# EAGLE design 9235HallEffectV1.0 (EAGLE 8.2.2)
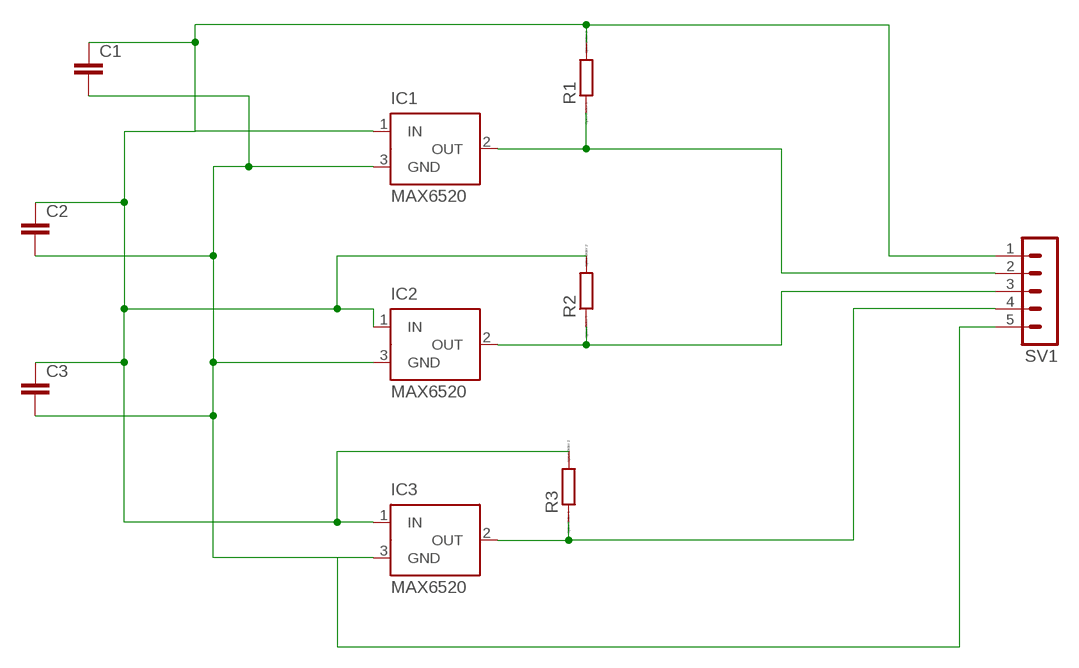
[diagram p0: schematic, sheet 1]

## Parts
C1  C-EUC0603  [C0603]
C2  C-EUC0603  [C0603]
C3  C-EUC0603  [C0603]
IC1  MAX6520  [SOT23]
IC2  MAX6520  [SOT23]
IC3  MAX6520  [SOT23]
R1  RR0603  [R0603]
R2  RR0603  [R0603]
R3  RR0603  [R0603]
SV1  MA05-1  [MA05-1]

## Nets
GND: C1.2 C2.2 C3.2 IC1.3(GND) IC2.3(GND) IC3.3(GND) SV1.5
H1: IC1.2(OUT) R1.1 SV1.2
H2: IC2.2(OUT) R2.1 SV1.3
H3: IC3.2(OUT) R3.1 SV1.4
VIN: C1.1 C2.1 C3.1 IC1.1(IN) IC2.1(IN) IC3.1(IN) R1.2 R2.2 R3.2 SV1.1

## Library data of the parts
C1-C3 = rcl:C-EU: CAPACITOR, European symbol
IC1-IC3 = maxim:MAX6520: 1.2V Voltage Reference 50ppm/°C, SOT23, 3-Terminal Source: Data sheet <http://datasheets.maxim-ic.com/en/ds/MAX6520.pdf>; MF: MAXIM; MPN: MAX6520EUR-T; OC_FARNELL: unknown; OC_NEWARK: 02J4586
R1-R3 = eagle-ltspice:R: RESISTOR, European symbol; SPICEMODEL: NONE; SPICEPREFIX: R
SV1 = con-lstb:MA05-1: PIN HEADER; OC_FARNELL: unknown; OC_NEWARK: unknown

## Net classes
0 default: width 0.508 mm, clearance 0.508 mm

## Board
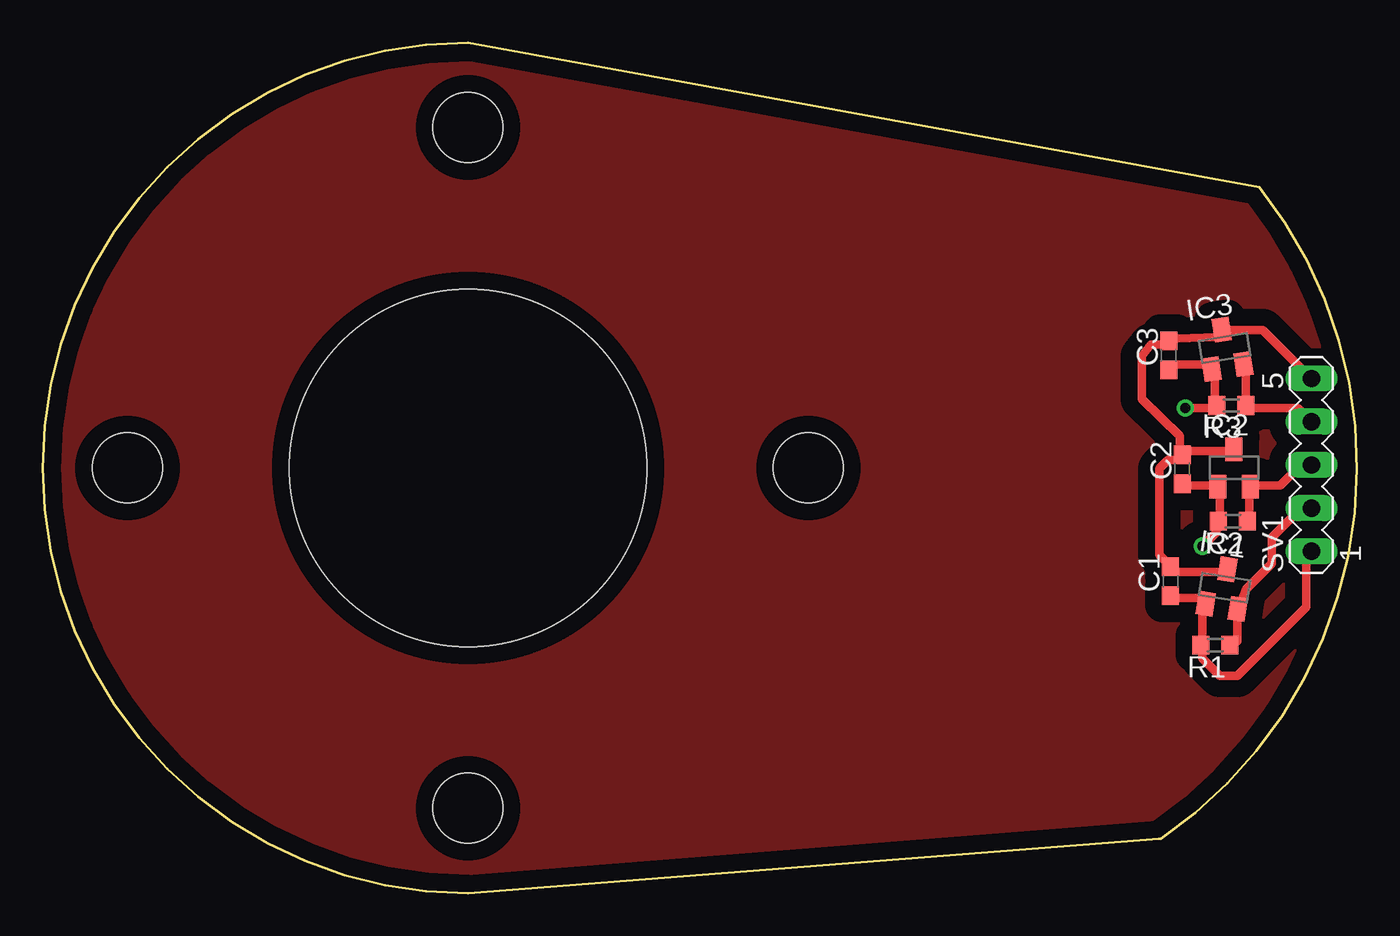
[diagram p1: board, top side]
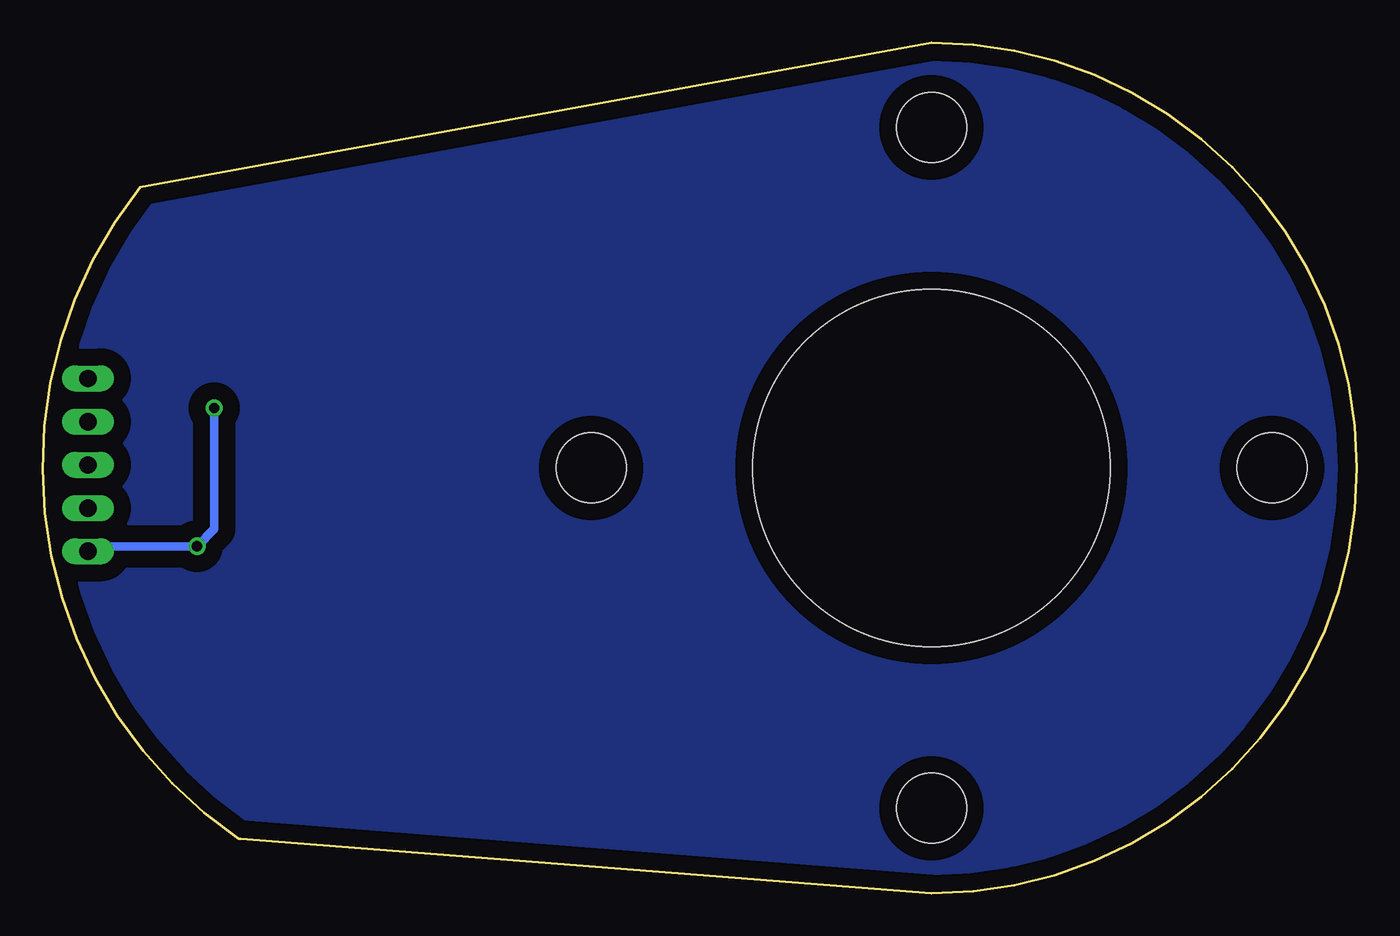
[diagram p2: board, bottom side, seen from below]

Size 77.23 x 50 mm. Coordinates in mm from the lower left corner, seen from the top.
Outline: 71.5,41.5 arc-94 65.7,3.2 65.6,3.2 25,0 arc-180 25,50 71.5,41.5
Copper layers (1*16): Top 0.035mm / dielectric 1.5mm / Bottom 0.035mm
Design rules "default": minimum track width 6mil, minimum drill 0.35mm, track to track 6mil, track to pad 6mil, pad to pad 6mil, via to via 6mil, smd to smd 6mil, copper to edge 40mil, drill to drill 6mil, minimum pad ring 10mil, minimum via ring 8mil, stop-mask expansion 4mil, vias tented up to drill 0mil, thermal gap 10mil
Holes 4.1 mm at 45,25 25,45 5,25 25,5
Holes 21 mm at 25,25

### Footprints (pad centres in the part's own frame; a part is rotated, then mirrored left to right if it is on the bottom)
C0603 = smd 1.1 x 1: 1 -0.85,0; 2 0.85,0
SOT23 = smd 1 x 1.4: 1 -0.95,-1.1; 2 0.95,-1.1; 3 0,1.1
R0603 = smd 1 x 1.1: 1 -0.85,0; 2 0.85,0
MA05-1 = drill 1.016 long: 1 -5.08,0; 2 -2.54,0; 3 0,0; 4 2.54,0; 5 5.08,0

### Placement (x,y rotation side)
C1  66.27,18.34 90 top
C2  66.97,24.93 90 top
C3  66.17,31.62 90 top
IC1  69.45,17.96 351 top
IC2  70,25 0 top
IC3  69.45,32.04 9 top
R1  68.91,14.59 180 top
R2  69.94,21.87 180 top
R3  69.85,28.67 180 top
SV1  74.55,25.18 90 top

### Tracks (layer width: path | path; a pad name or v marks a point on that pad's centre or on a via)
GND
  Top 0.508: C2.2 67.14,25.99 69.68,25.99 IC2.3 | IC1.3 69.17,18.88 66.63,18.88 C1.2 66.12,19.38 65.61,19.89 65.61,24.97 66.12,25.48 66.63,25.48 C2.2 | SV1.5 74.25,30.56 71.71,33.1 69.68,33.1 IC3.3 69.17,33.1 69.06,32.69 66.63,32.59 C3.2 66.13,32.26 65.11,32.26 64.6,31.58 64.6,29.04 66.83,26.86 66.83,25.85 C2.2
H1
  Top 0.508: R1.1 70.18,14.81 70.18,16.34 IC1.2 70.31,16.88 70.69,17.86 72.22,19.38 72.22,20.91 74.25,22.94 SV1.2
H2
  Top 0.508: R2.1 70.91,21.93 70.91,23.46 IC2.2 71.2,23.96 72.72,23.96 74.25,25.48 SV1.3
H3
  Top 0.508: IC3.2 70.69,31.07 70.69,29.04 R3.1 70.69,28.53 73.74,28.53 74.25,28.02 SV1.4
N$3
  pour Bottom (isolate 1): 71,42 77,30 77,19 72,9 66,3 24,0 13,3 6,8 2,15 0,25 2,35 7,43 16,48 25,50
N$4
  pour Top (isolate 1): 25,50 71,42 77,30 77,19 72,9 66,3 24,0 13,3 6,8 2,15 0,24 2,35 7,43 16,48
VIN  (via drill 0.6)
  Top 0.508: C1.1 66.63,17.35 68.15,17.35 IC1.1 68.15,16.84 68.15,14.81 R1.2 68.15,14.3 68.15,13.8 69.17,12.78 70.18,12.78 74.25,16.84 74.25,19.89 SV1.1 | C3.1 66.63,31.07 68.66,31.07 IC3.1 68.89,30.59 68.89,29.07 R3.2 68.66,28.53 v67.14,28.53 | C2.1 67.14,23.96 68.66,23.96 IC2.1 69.17,23.45 69.17,21.92 R2.2 68.97,21.22 68.66,20.91 v68.15,20.4
  Bottom 0.508: SV1.1 74.25,20.4 v68.15,20.4 67.14,21.42 v67.14,28.53